# Altium schematic sheet Frontend.SchDoc
size C; SheetNumber: 4; SheetTotal: 5
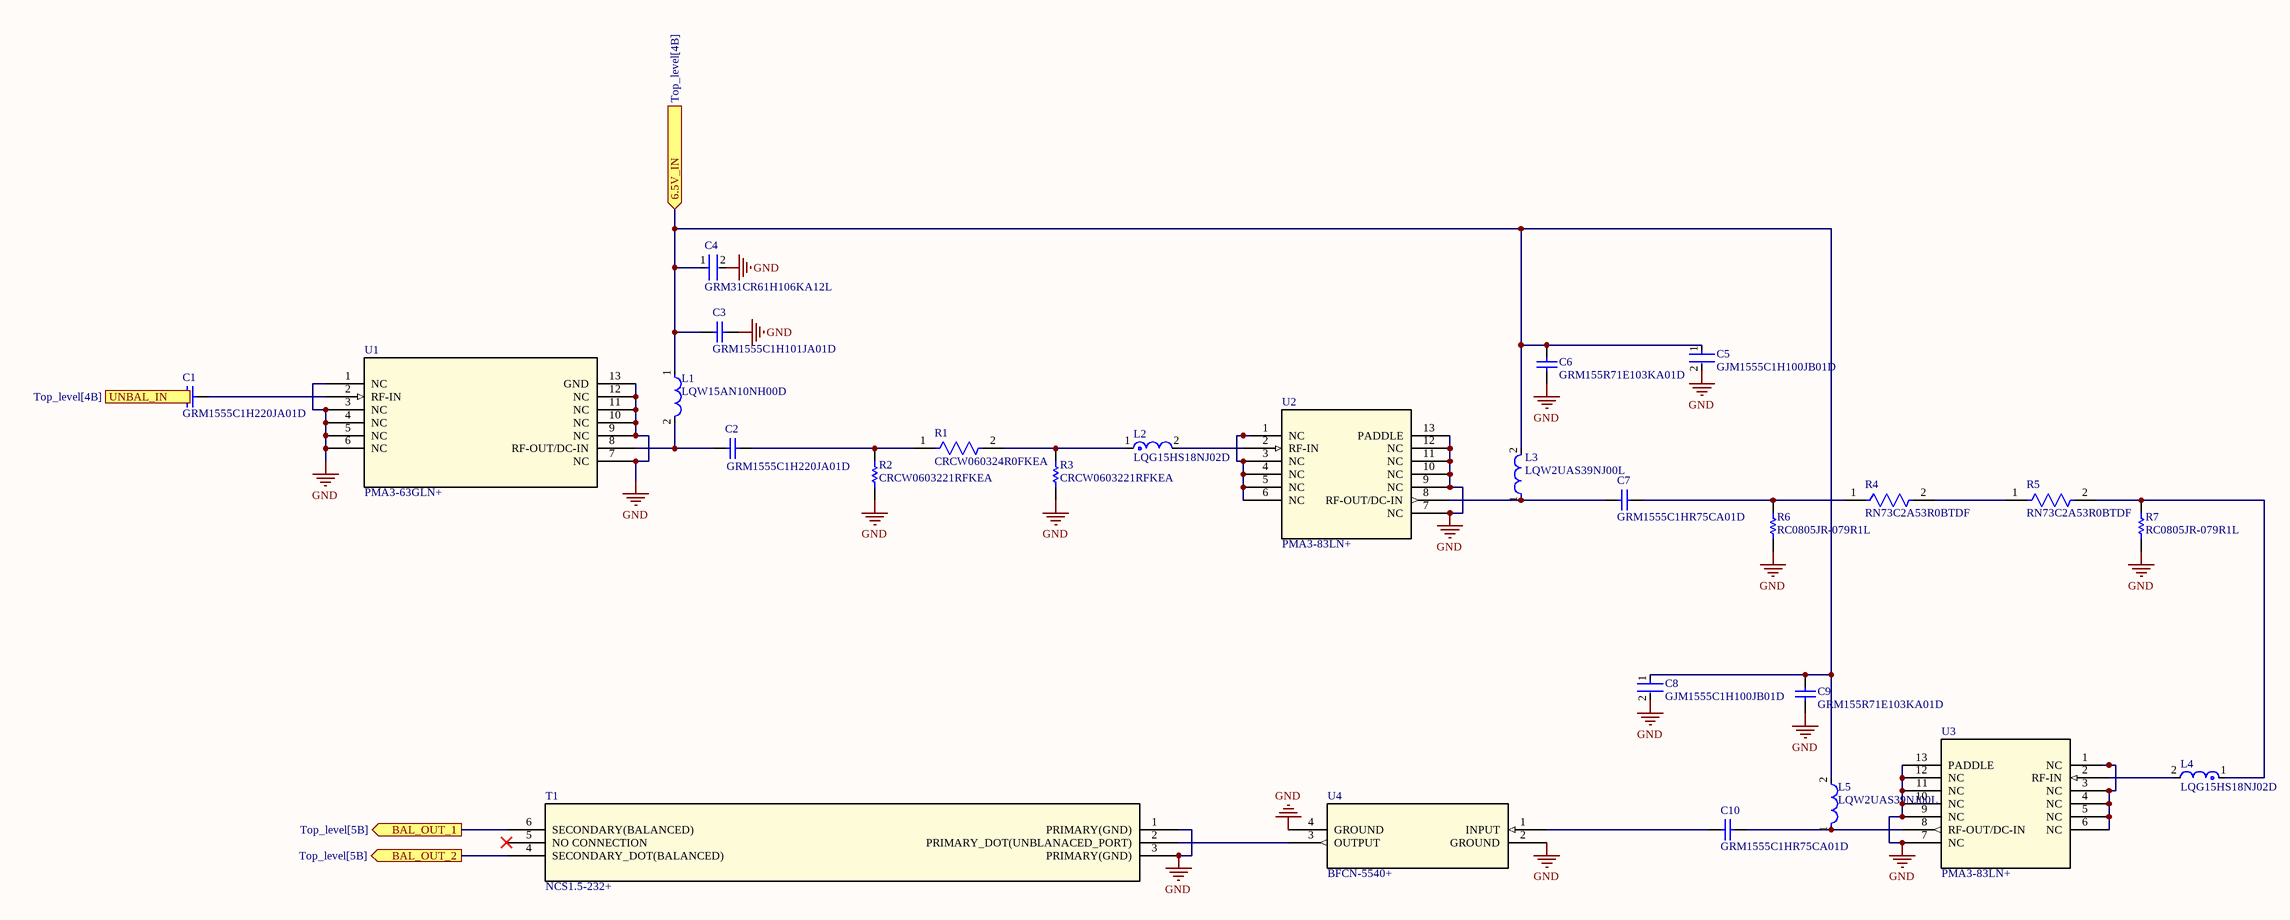
[diagram p0: Frontend.SchDoc]

## Parts
C1  GRM1555C1H220JA01D  [CAPC1005X55X25NL05T10]
C2  GRM1555C1H220JA01D  [CAPC1005X55X25NL05T10]
C3  GRM1555C1H101JA01D  [CAPC1005X55X25ML05T10]
C4  GRM31CR61H106KA12L  [FP-GRM31-0_2-MFG]
C5  GJM1555C1H100JB01D  [FP-GJM155-0_05-IPC_A]
C6  GRM155R71E103KA01D  [CAPC1005X55X25LL05T10]
C7  GRM1555C1HR75CA01D  [CAPC1005X55X25LL05T10]
C8  GJM1555C1H100JB01D  [FP-GJM155-0_05-IPC_A]
C9  GRM155R71E103KA01D  [CAPC1005X55X25LL05T10]
C10  GRM1555C1HR75CA01D  [CAPC1005X55X25LL05T10]
L1  LQW15AN10NH00D  [FP-LQW15AN_00-W0_6-0_1-MFG]
L2  LQG15HS18NJ02D  [FP-LQG15HH_02-MFG]
L3  LQW2UAS39NJ00L  [FP-LQW2UAS_00-MFG]
L4  LQG15HS18NJ02D  [FP-LQG15HH_02-MFG]
L5  LQW2UAS39NJ00L  [FP-LQW2UAS_00-MFG]
R1  CRCW060324R0FKEA  [FP-CRCW0603-e3-MFG]
R2  CRCW0603221RFKEA  [RESC1609X50X30LL10T20]
R3  CRCW0603221RFKEA  [RESC1609X50X30LL10T20]
R4  RN73C2A53R0BTDF  [FP-RN732A-MFG]
R5  RN73C2A53R0BTDF  [FP-RN732A-MFG]
R6  RC0805JR-079R1L  [RESC2013X60X35LL10T20]
R7  RC0805JR-079R1L  [RESC2013X60X35LL10T20]
T1  NCS1.5-232+  [GE0805C-9_MNC]
U1  PMA3-63GLN+  [DQ1225_MNC]
U2  PMA3-83LN+  [DQ1225_MNC]
U3  PMA3-83LN+  [DQ1225_MNC]
U4  BFCN-5540+  [FV1206-4_MNC]

## Ports
6.5V_IN (in, see Top_level[4B]), BAL_OUT_1 (out, see Top_level[5B]), BAL_OUT_2 (out, see Top_level[5B]), UNBAL_IN (in, see Top_level[4B])

## Nets
GND: C3.2 C4.2 C5.2 C6.1 C8.2 C9.1 R2.1 R3.1 R6.1 R7.1 T1.1(PRIMARY(GND)) T1.3(PRIMARY(GND)) U1.1(NC) U1.3(NC) U1.4(NC) U1.5(NC) U1.6(NC) U1.7(NC) U1.9(NC) U1.10(NC) U1.11(NC) U1.12(NC) U1.13(GND) U2.7(NC) U2.9(NC) U2.10(NC) U2.11(NC) U2.12(NC) U2.13(PADDLE) U3.7(NC) U3.9(NC) U3.10(NC) U3.11(NC) U3.12(NC) U3.13(PADDLE) U4.2(GROUND) U4.4(GROUND)
6.5V_IN: C3.1 C4.1 C5.1 C6.2 C8.1 C9.2 L1.1 L3.2 L5.2 ; port 6.5V_IN
BAL_OUT_1: T1.6(SECONDARY(BALANCED)) ; port BAL_OUT_1
BAL_OUT_2: T1.4(SECONDARY_DOT(BALANCED)) ; port BAL_OUT_2
NetC1_1: C1.1 U1.2(RF-IN)
NetC2_1: C2.1 L1.2 U1.8(RF-OUT/DC-IN)
NetC2_2: C2.2 R1.1 R2.2
NetC7_1: C7.1 L3.1 U2.8(RF-OUT/DC-IN)
NetC7_2: C7.2 R4.1 R6.2
NetC10_1: C10.1 L5.1 U3.8(RF-OUT/DC-IN)
NetC10_2: C10.2 U4.1(INPUT)
NetL2_1: L2.1 R1.2 R3.2
NetL2_2: L2.2 U2.2(RF-IN)
NetL4_1: L4.1 R5.2 R7.2
NetL4_2: L4.2 U3.2(RF-IN)
NetR4_2: R4.2 R5.1
NetT1_2: T1.2(PRIMARY_DOT(UNBLANACED_PORT)) U4.3(OUTPUT)
NetU2_1: U2.1(NC) U2.3(NC) U2.4(NC) U2.5(NC) U2.6(NC)
NetU3_1: U3.1(NC) U3.3(NC) U3.4(NC) U3.5(NC) U3.6(NC)

Not connected (* = marked no-connect by the designer): C1 2; T1 5(NO_CONNECTION)*

## Library data of the parts
C1 C2 = CMP-2008-04302-1: Manufacturer: Murata; Part Number: GRM1555C1H220JA01D
C3 = CMP-2008-03915-1: Manufacturer: Murata; Part Number: GRM1555C1H101JA01D
C4 = CMP-2000-05256-2: CAP CER 10UF 50V X5R 1206; Manufacturer: Murata Electronics North America; Tolerance: 10%; Temperature Coefficient: 15%; Material: Ceramic; Height: 1.8mm; Temperature: -55°C to +85°C; Lead Free: Yes; Temperature Characteristic: X5R; ComponentLink2Description: Datasheet; Digikey Description: CAP CER 10UF 50V X5R 1206; Octopart: https://octopart.com/grm31cr61h106ka12l-murata-18903335; Device Class L2: Capacitors; Automotive: No; Value: 10uF; Temperature Range High: +85°C; Temperature Range Low: -55°C; Device Class L3: Ceramic Capacitors; Voltage Rating: 50V; Capacitance: 10uF; Device Class L1: Passive Components; Mouser Description: Multilayer Ceramic Capacitors MLCC - SMD/SMT 1206 10uF 50volt X5R +/-10%; ComponentLink2URL: https://search.murata.co.jp/Ceramy/image/img/A01X/G101/ENG/GRM31CR61H106KA12-01A.pdf; Manufacturer Part Number: GRM31CR61H106KA12L; Package: GRM31-0.2; RoHS: TRUE; Category: Cap
C5 C8 = CMP-2008-03797-2: Multi-Layer Ceramic Capacitor 10pF C0G  ±5% 0402 Paper T/R; Voltage Rating (DC): 50V; Mount: Surface Mount; Width: 0.02inch; Height: 0.5mm; Termination: SMD/SMT; Capacitance: 10pF; Packaging: Tape and Reel; Case Code (Metric): 1005; Depth: 0.5mm; Min Operating Temperature: -55°C; Case/Package: 0402; Voltage Rating: 50V; Tolerance: 5%; Lead Free: Lead Free; Package Quantity: 1; Case Code (Imperial): 0402; Radiation Hardening: No; Length: 1mm; Voltage: 50V; Dielectric: C0G; Thickness: 0.022inch; Max Operating Temperature: 125°C
C6 C9 = CMP-1034-01880-2: Manufacturer: Murata; Part Number: GRM155R71E103KA01D
C7 C10 = CMP-2008-04480-1: Manufacturer: Murata; Part Number: GRM1555C1HR75CA01D
L1 = CMP-06042-000413-1: Wire Wound RF Inductor 10nH ±3% 500mA 0.17Ω 0402 (1005); Q Factor: 25; Core Material: Non-Magnetic; Test Frequency: 100MHz; DC Resistance (DCR): 170mR; Self Resonant Frequency: 5.5GHz; Shielding: Unshielded; Current: 370mA; Inductance: 10nH; Case Code (Imperial): 0402; Package Quantity: 10000; Height: 0.5mm; Width: 0.02inch; Case Code (Metric): 1005; Tolerance: 3%; Min Operating Temperature: -55°C; Packaging: Tape and Reel; Length: 1mm; DC Current: 500mA; Current Rating: 500mA; Military Standard: Not; Max DC Current: 500mA; Case/Package: 0402; Lead Free: Lead Free; Radiation Hardening: No; Weight: 2.8E-05oz; Height - Seated (Max): 0.024inch; Depth: 0.7mm; Termination: SMD/SMT; Resistor Type: Wirewound; Max Operating Temperature: 125°C; Mount: Surface Mount
L2 L4 = CMP-06042-000668-1: Multilayer type RF Inductor 18nH ±5% 0.36Ω 400mA 0402; DC Current: 300mA; Test Frequency: 100MHz; Self Resonant Frequency: 2.2GHz; Shielding: Unshielded; Core Material: Air; DC Resistance (DCR): 360mR; Q Factor: 8; Inductance: 18nH; Military Standard: Not; REACH SVHC: No SVHC; Tolerance: 5%; Inductance Tolerance: 5%; Weight: 2.3E-05oz; Lead Free: Lead Free; Depth: 0.55mm; Current Rating: 300mA; Max DC Current: 300mA; Max Operating Temperature: 125°C; Length: 0.039inch; Min Operating Temperature: -55°C; Width: 0.5mm; Radiation Hardening: No; Termination: SMD/SMT; Height: 0.5mm; Package Quantity: 10000; Packaging: Tape and Reel; Case/Package: 0402; Case Code (Imperial): 0402; Mount: Surface Mount; Height - Seated (Max): 0.022inch; Case Code (Metric): 1005
L3 L5 = CMP-06042-008950-1: Wire Wound RF Inductor 39nH ±5% 1000mA 0.15Ω 1008 (2520); Q Factor: 60; Test Frequency: 50MHz; Max DC Current: 1A; Self Resonant Frequency: 1.5GHz; DC Resistance (DCR): 150mR; Core Material: Air; Shielding: Unshielded; Package Quantity: 1; Radiation Hardening: No; Weight: 0.001376oz; Case Code (Metric): 2520; Max Operating Temperature: 125°C; Case Code (Imperial): 1008; Inductance Tolerance: 5%; Current Rating: 1A; Resistor Type: Wirewound; Inductance: 39nH; Mount: Surface Mount; Width: 0.096inch; Min Operating Temperature: -55°C; Packaging: Tape and Reel; Length: 0.103inch; Case/Package: 1008; Termination: SMD/SMT; Height: 1.83mm; REACH SVHC: No SVHC; Depth: 2.65mm; Height - Seated (Max): 0.08inch; Tolerance: 5%
R1 = CMP-2000-03123-2: RES Thick Film, 24Ω, 1%, 0.1W, 100ppm/°C, 0603; Voltage Rating (DC): 75V; Power Rating: 100mW; Resistance: 24R; Case/Package: 0603; Composition: Thick Film; Temperature Coefficient: 100ppm/°C; Length: 1.55mm; Military Standard: Not; Tolerance: 1%; Height: 0.45mm; Width: 0.033inch; Case Code (Imperial): 0603; Weight: 7.1E-05oz; Depth: 0.85mm; Radiation Hardening: No; Packaging: Tape and Reel; Number of Terminations: 2; Case Code (Metric): 1608; Termination: SMD/SMT; Package Quantity: 10; Max Power Dissipation: 100mW; Min Operating Temperature: -55°C; Max Operating Temperature: 155°C; Contact Plating: Tin; Number of Pins: 2; Voltage Rating: 75V; Lead Free: Lead Free; Features: Automotive AEC-Q200
R2 R3 = CMP-2000-03090-1: Manufacturer: Vishay Dale; Part Number: CRCW0603221RFKEA
R4 R5 = CMP-03211-003837-1: SMD Chip Resistor, Thin Film, 53.0Ω, 100 V, 0805 [2012 Metric], 100 mW, 0.1%, RN73 Series; Manufacturer: TE Connectivity; Power Rating: 0.1W; Temperature Coefficient: 10ppm/°C; Voltage Rating: 100V; Ipc Land Pattern Name: RESC200125X55; Device Class L2: Resistors; Lead Free: Yes; Octopart: https://octopart.com/rn73c2a53r0btdf-te+connectivity-22742106; Resistance: 53.0Ω; Temperature: -55°C to 155°C; Package: RN732A; Height: 0.65mm; Temperature Range Low: -55°C; Device Class L3: Chip SMD Resistors; octopart_url: https://octopart.com/rn73c2a53r0btdf-te+connectivity-22742106; Automotive: No; RoHS: TRUE; Device Class L1: Passive Components; packaging: 1000 Reel; Value: 53.0Ω; ComponentLink2URL: https://www.te.com/commerce/DocumentDelivery/DDEController?Action=showdoc&DocId=Data+Sheet%7F1773270%7FP%7Fpdf%7FEnglish%7FENG_DS_1773270_P.pdf%7F1676162-2; ComponentLink2Description: Datasheet; Series: RN73; Manufacturer Part Number: RN73C2A53R0BTDF; Temperature Range High: 155°C; Category: Res; Composition: Thin Film; Tolerance: 0.1%
R6 R7 = CMP-2001-01410-1: Manufacturer: Yageo; Part Number: RC0805JR-079R1L
T1 = NCS1.5-232+: No Description Available; Mfr_Name: Mini Circuits; Type: DEV; Copyright: Copyright (C) 2023 Ultra Librarian. All rights reserved.; Manufacturer_Part_Number: NCS1.5-232+; RefDes: RefDes
U1 = PMA3-63GLN+: No Description Available; Mfr_Name: Mini Circuits; Copyright: Copyright (C) 2023 Ultra Librarian. All rights reserved.; Manufacturer_Part_Number: PMA3-63GLN+; RefDes: RefDes; Type: DEV
U2 U3 = PMA3-83LN+: No Description Available; Mfr_Name: Mini Circuits; Copyright: Copyright (C) 2023 Ultra Librarian. All rights reserved.; Manufacturer_Part_Number: PMA3-83LN+; RefDes: RefDes; Type: DEV
U4 = BFCN-5540+: No Description Available; Mfr_Name: Mini Circuits; Copyright: Copyright (C) 2023 Ultra Librarian. All rights reserved.; Manufacturer_Part_Number: BFCN-5540+; RefDes: RefDes; Type: DEV